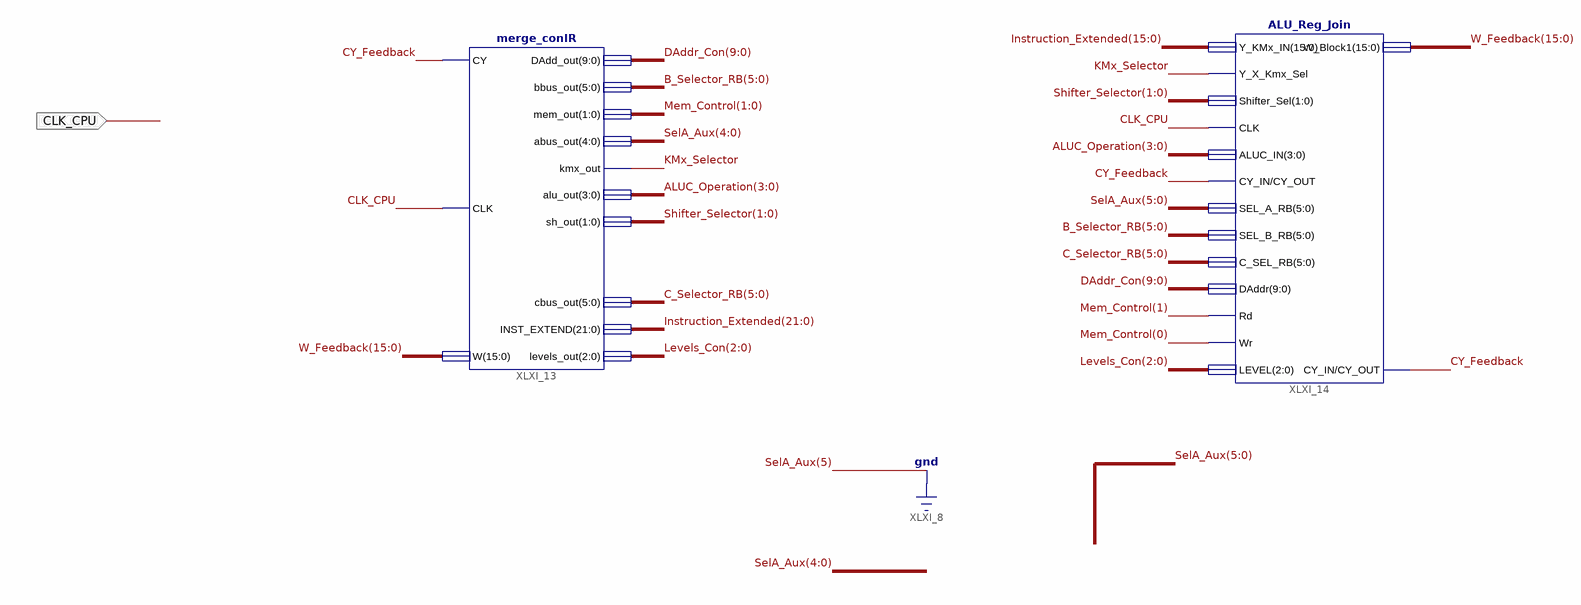
[diagram p0: schematic sheet 1]
// Xilinx ISE schematic CPU_main.sch (artix7) as structural Verilog: 2 symbols, 1 ports
module CPU_main (
  input  CLK_CPU
);

  wire CY_Feedback, KMx_Selector;
  wire [1:0] Mem_Control, Shifter_Selector;
  wire [2:0] Levels_Con;
  wire [3:0] ALUC_Operation;
  wire [4:0] SelA_Aux;
  wire [5:0] B_Selector_RB, C_Selector_RB;
  wire [9:0] DAddr_Con;
  wire [15:0] W_Feedback;
  wire [21:0] Instruction_Extended;

  merge_conIR XLXI_13 (
    .CY(CY_Feedback), .CLK(CLK_CPU), .W(W_Feedback), .DAdd_out(DAddr_Con), .bbus_out(B_Selector_RB),
    .mem_out(Mem_Control), .abus_out(SelA_Aux), .kmx_out(KMx_Selector), .alu_out(ALUC_Operation),
    .sh_out(Shifter_Selector), .cbus_out(C_Selector_RB), .INST_EXTEND(Instruction_Extended),
    .levels_out(Levels_Con));
  ALU_Reg_Join XLXI_14 (
    .Y_KMx_IN(Instruction_Extended[15:0]), .Y_X_Kmx_Sel(KMx_Selector), .Shifter_Sel(Shifter_Selector),
    .CLK(CLK_CPU), .ALUC_IN(ALUC_Operation), .CY_IN(CY_Feedback), .SEL_A_RB({1'b0, SelA_Aux}),
    .SEL_B_RB(B_Selector_RB), .C_SEL_RB(C_Selector_RB), .DAddr(DAddr_Con), .Rd(Mem_Control[1]),
    .Wr(Mem_Control[0]), .LEVEL(Levels_Con), .W_Block1(W_Feedback), .CY_OUT(CY_Feedback));
endmodule
